# Altium schematic sheet Reguladores.SchDoc: Reguladores voltaje
size A4; Engineer: Nuria Parra; Organization: Altium Limited; Address1: L3, 12a Rodborough Rd; Address2: Frenchs Forest; Address3: NSW; Address4: Australia 2086; Revision: 1
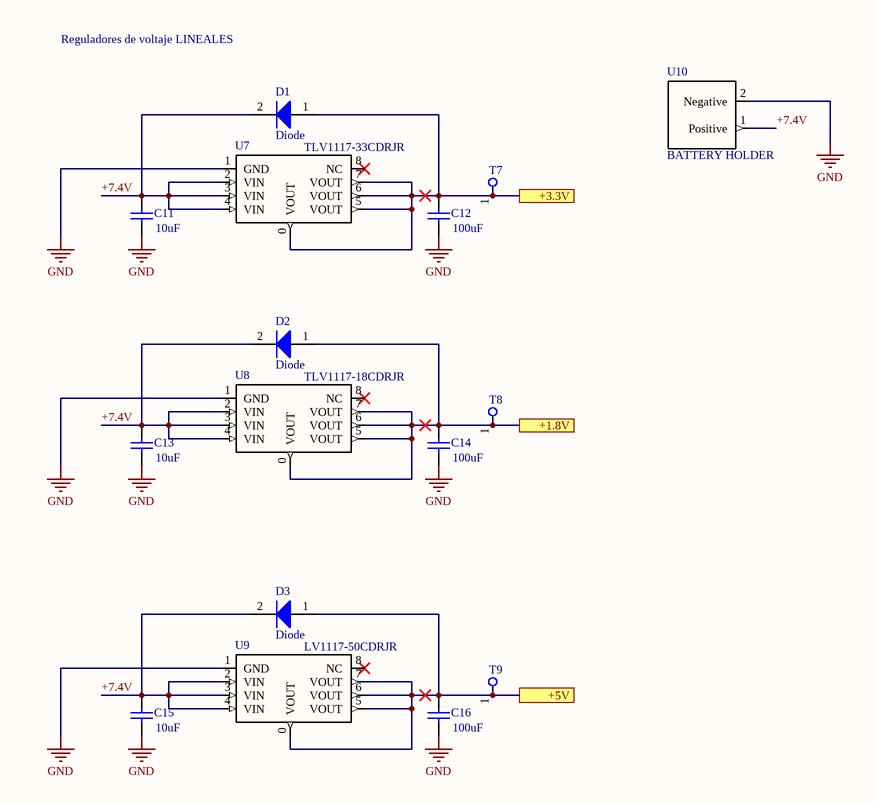
[diagram p0: Reguladores.SchDoc]

## Parts
C11  value 10uF  [0603 Cap]  (hidden comment: Cap)
C12  value 100uF  [3216 Tantalum]  (hidden comment: Cap)
C13  value 10uF  [0603 Cap]  (hidden comment: Cap)
C14  value 100uF  [3216 Tantalum]  (hidden comment: Cap)
C15  value 10uF  [0603 Cap]  (hidden comment: Cap)
C16  value 100uF  [3216 Tantalum]  (hidden comment: Cap)
D1  Diode  [SOD-123]
D2  Diode  [SOD-123]
D3  Diode  [SOD-123]
T7  testpoint  [testpoint]  (value not drawn)
T8  testpoint  [testpoint]  (value not drawn)
T9  testpoint  [testpoint]  (value not drawn)
U7  TLV1117-33CDRJR  [TLV1117]
U8  TLV1117-18CDRJR  [TLV1117]
U9  LV1117-50CDRJR  [TLV1117]
U10  BATTERY HOLDER  [battery holder 224]

## Ports
+1.8V, +3.3V, +5V

## Nets
GND: C11.1 C12.1 C13.1 C14.1 C15.1 C16.1 U7.1(GND) U8.1(GND) U9.1(GND) U10.2(Negative)
+1.8V: C14.2 D2.1(A) T8.1(TP) U8.0(VOUT) U8.5(VOUT) U8.6(VOUT) U8.7(VOUT) ; port +1.8V
+3.3V: C12.2 D1.1(A) T7.1(TP) U7.0(VOUT) U7.5(VOUT) U7.6(VOUT) U7.7(VOUT) ; port +3.3V
+5V: C16.2 D3.1(A) T9.1(TP) U9.0(VOUT) U9.5(VOUT) U9.6(VOUT) U9.7(VOUT) ; port +5V
+7.4V: C11.2 C13.2 C15.2 D1.2(C) D2.2(C) D3.2(C) U7.2(VIN) U7.3(VIN) U7.4(VIN) U8.2(VIN) U8.3(VIN) U8.4(VIN) U9.2(VIN) U9.3(VIN) U9.4(VIN) U10.1(Positive)

Not connected (* = marked no-connect by the designer): U7 8(NC)*; U8 8(NC)*; U9 8(NC)*

## Notes on the sheet
- Reguladores lineales. Condensadores de 1uF Ceramic 10V, X5R, size 0402. Enable a nivel alto
- Reguladores de voltaje LINEALES
- Title:
- Size:
- Author:
- Date:
- A4
- Revision:

## Library data of the parts
U7-U9 = TLV1117